# Altium schematic sheet Micro.SchDoc: nRF2789_Dual_Wireless_Mic_RX
size A4; DrawnBy: ANOL; Revision: 1.0
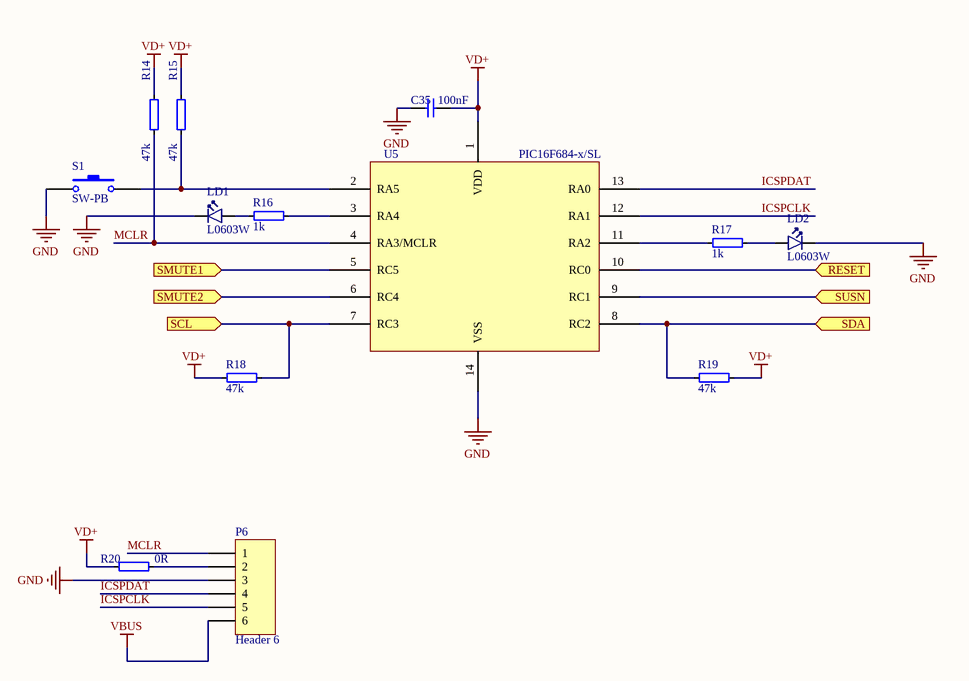
[diagram p0: Micro.SchDoc]

## Parts
C35  100nF  [0402s]
LD1  L0603W  [LED_0603]
LD2  L0603W  [LED_0603]
P6  Header 6  [HDR1X6]
R14  47k  [0402s]
R15  47k  [0402s]
R16  1k  [0402s]
R17  1k  [0402s]
R18  47k  [0402s]
R19  47k  [0402s]
R20  0R  [0402s]
S1  SW-PB  [E-Switch]
U5  PIC16F684-x/SL  [TSOP65P640X120-14N]

## Ports
RESET (in), SCL (in), SDA (in), SMUTE1 (in), SMUTE2 (in), SUSN (in)

## Nets
GND: C35.1 LD1.1(C) LD2.1(C) P6.3 S1.1 U5.14(VSS)
VBUS: P6.6
VD+: C35.2 R14.2 R15.2 R18.1 R19.1 R20.1 U5.1(VDD)
ICSPCLK: P6.5 U5.12(RA1)
ICSPDAT: P6.4 U5.13(RA0)
MCLR: P6.1 R14.1 U5.4(RA3/MCLR)
RESET: U5.10(RC0) ; port RESET
SCL: R18.2 U5.7(RC3) ; port SCL
SDA: R19.2 U5.8(RC2) ; port SDA
SMUTE1: U5.5(RC5) ; port SMUTE1
SMUTE2: U5.6(RC4) ; port SMUTE2
SUSN: U5.9(RC1) ; port SUSN
NetLD1_2: LD1.2(A) R16.2
NetLD2_2: LD2.2(A) R17.2
NetP6_2: P6.2 R20.2
NetR15_1: R15.1 S1.2 U5.2(RA5)
NetR16_1: R16.1 U5.3(RA4)
NetR17_1: R17.1 U5.11(RA2)

## Library data of the parts
C35 = C0402-100n: Chip Cap 0402; Note: Chip Cap 10%; Artikkelnr Noca: 20039200; Part Number: C0402-100n; Manufacturer: *; Manufacturer Part Number: *; Datasheet: *; LatestRevisionDate: 2009-11-23; Pin Count: 2; Publisher: Nordic Semiconductor; Published: 2009-05-08; Value: 100nF; Supplier: *; Supplier part number: *; 2nd source Supplier: *; 2nd source part number: *
LD1 LD2 = 19-213/W1D: LED 0603, 19-213/W1D; Manufacturer: Everlight; Note: 45 mcd; Artikkelnr Noca: N.A.; Part Number: 19-213/W1D; Manufacturer Part Number: *; Datasheet: *; Footprint: 0603; LatestRevisionDate: 2009-05-18; Pin Count: 2; Publisher: Nordic Semiconductor; Published: 2009-05-18; Value: L0603W; Supplier: *; Supplier part number: *; 2nd source Supplier: *; 2nd source part number: *
P6 = Header 6: Header, 6-Pin; LatestRevisionDate: 17-Jul-2002; LatestRevisionNote: Re-released for DXP Platform.; Publisher: Altium Limited
R14 R15 R18 R19 = R0402-47k: Chip Res 0402; Note: Chip Res 1%; Artikkelnr Noca: 27049113; Part Number: R0402-47k; Manufacturer: *; Manufacturer Part Number: *; Datasheet: *; Footprint: 0402; LatestRevisionDate: 2009-11-23; Pin Count: 2; Publisher: Nordic Semiconductor; Published: 2009-05-08; Value: 47k; Supplier: *; Supplier part number: *; 2nd source Supplier: *; 2nd source part number: *
R16 R17 = R0402-1k0: Chip Res 0402; Note: Chip Res 1%; Artikkelnr Noca: 27049073; Part Number: R0402-1k0; Manufacturer: *; Manufacturer Part Number: *; Datasheet: *; Footprint: 0402; LatestRevisionDate: 2009-11-23; Pin Count: 2; Publisher: Nordic Semiconductor; Published: 2009-05-08; Value: 1k; Supplier: *; Supplier part number: *; 2nd source Supplier: *; 2nd source part number: *
R20 = R0402-0R: Chip Res 0402; Note: Chip Res 1%; Artikkelnr Noca: 27049000; Part Number: R0402-0R; Manufacturer: *; Manufacturer Part Number: *; Datasheet: *; Footprint: 0402; LatestRevisionDate: 2009-11-23; Pin Count: 2; Publisher: Nordic Semiconductor; Published: 2009-05-08; Value: 0R; Supplier: *; Supplier part number: *; 2nd source Supplier: *; 2nd source part number: *
S1 = SW-PB: Switch; Published: 24-Mar-1999; LatestRevisionDate: 17-Jul-2002; LatestRevisionNote: Re-released for DXP Platform.; PackageReference: SPST-2; Publisher: Altium Limited; PackageDescription: Switch; 2 Leads